# Altium schematic sheet drive.SchDoc
size A4
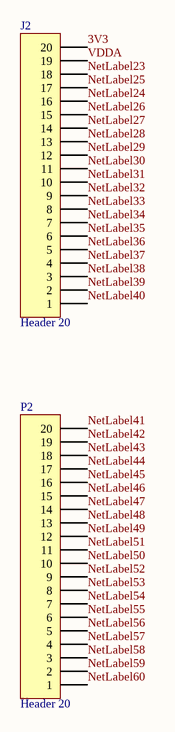
[diagram p0: drive.SchDoc]

## Parts
J2  Header 20  [HDR1X20]
P2  Header 20  [HDR1X20]

## Nets
3V3: J2.20
NetLabel23: J2.18
NetLabel24: J2.16
NetLabel25: J2.17
NetLabel26: J2.15
NetLabel27: J2.14
NetLabel28: J2.13
NetLabel29: J2.12
NetLabel30: J2.11
NetLabel31: J2.10
NetLabel32: J2.9
NetLabel33: J2.8
NetLabel34: J2.7
NetLabel35: J2.6
NetLabel36: J2.5
NetLabel37: J2.4
NetLabel38: J2.3
NetLabel39: J2.2
NetLabel40: J2.1
NetLabel41: P2.20
NetLabel42: P2.19
NetLabel43: P2.18
NetLabel44: P2.17
NetLabel45: P2.16
NetLabel46: P2.15
NetLabel47: P2.14
NetLabel48: P2.13
NetLabel49: P2.12
NetLabel50: P2.10
NetLabel51: P2.11
NetLabel52: P2.9
NetLabel53: P2.8
NetLabel54: P2.7
NetLabel55: P2.6
NetLabel56: P2.5
NetLabel57: P2.4
NetLabel58: P2.3
NetLabel59: P2.2
NetLabel60: P2.1
VDDA: J2.19

## Library data of the parts
J2 P2 = Header 20: Header, 20-Pin; LatestRevisionDate: 17-Jul-2002; LatestRevisionNote: Re-released for DXP Platform.; Publisher: Altium Limited